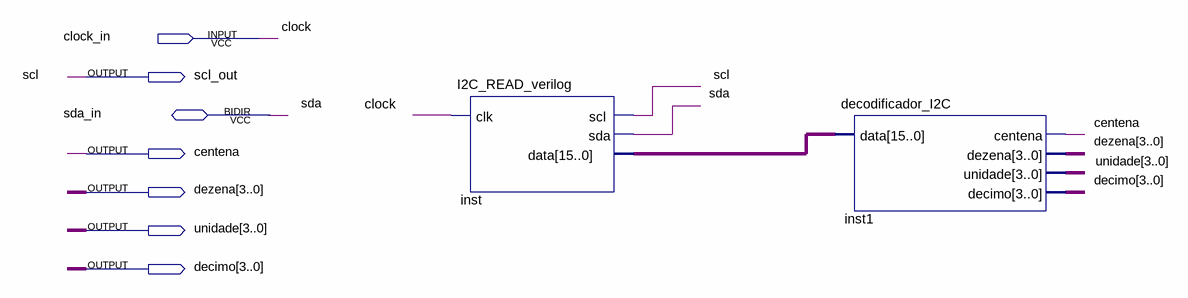
[diagram p0: schematic sheet]
// Quartus schematic Bloco_Sensor_Temperatura.bdf as structural Verilog: 2 symbols, 7 pins
module Bloco_Sensor_Temperatura (
  input  clock_in,
  inout  sda_in,
  output scl_out,
  output centena,
  output [3:0] dezena,
  output [3:0] unidade,
  output [3:0] decimo
);

  wire [15:0] inst_data;

  I2C_READ_verilog inst (.clk(clock_in), .scl(scl_out), .data(inst_data), .sda(sda_in));
  decodificador_I2C inst1 (.data(inst_data), .centena(centena), .dezena(dezena), .unidade(unidade), .decimo(decimo));

  // Other names for the same wires on the sheet: clock = clock_in; scl = scl_out; sda = sda_in
endmodule
